# Altium schematic sheet Encoder.SchDoc
size A4; SheetNumber: 7; SheetTotal: 13
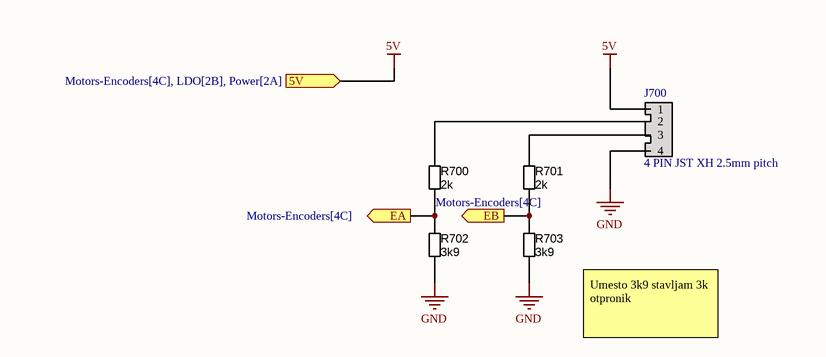
[diagram p0: Encoder.SchDoc]

## Parts
J700  4 PIN JST XH 2.5mm pitch  [JST4PIN]
R700  2k  [RES_0603]
R701  2k  [RES_0603]
R702  3k9  [RES_0603]
R703  3k9  [RES_0603]

## Ports
5V (in, see Motors-Encoders[4C], LDO[2B], Power[2A]), EA (out, see Motors-Encoders[4C]), EB (out, see Motors-Encoders[4C])

## Nets
5V: J700.1 ; port 5V
GND: J700.4 R702.1 R703.1
EA: R700.1 R702.2 ; port EA
EB: R701.1 R703.2 ; port EB
NetJ700_2: J700.2 R700.2
NetJ700_3: J700.3 R701.2

## Notes on the sheet
- Umesto 3k9 stavljam 3k otpronik

## Library data of the parts
J700 = JST4PIN
R700 R701 = R000004: RES 2k OHM 1% 1/10W 0603; resistance: 1Kohm; ComponentLink1Description: digikey; ComponentLink1URL: https://www.digikey.com/en/products/detail/vishay-beyschlag-draloric-bc-components/MCT06030C1001FP500/2607821
R702 R703 = R000004: RES 3k9 OHM 1% 1/10W 0603; resistance: 1Kohm; ComponentLink1Description: digikey; ComponentLink1URL: https://www.digikey.com/en/products/detail/vishay-beyschlag-draloric-bc-components/MCT06030C1001FP500/2607821